# Altium schematic sheet RT1064_Interaction.SchDoc
size A4; SheetNumber: 3; SheetTotal: 4
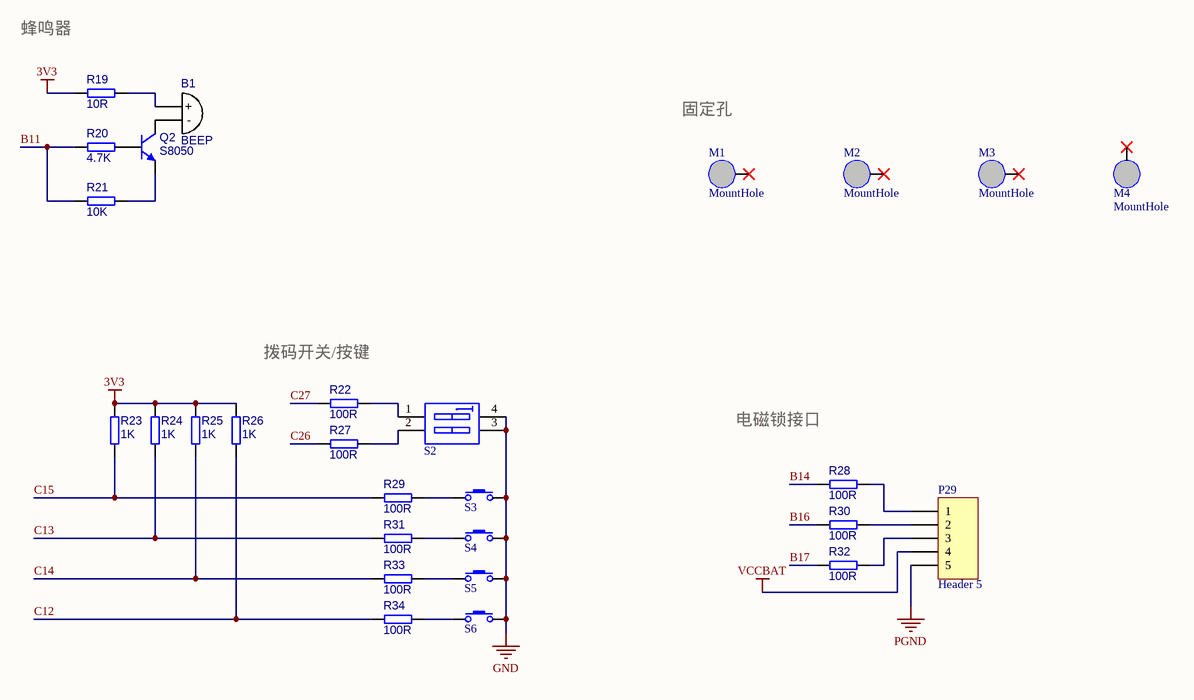
[diagram p0: RT1064_Interaction.SchDoc]

## Parts
B1  BEEP  [BEEP 9x5.5mm]
M1  MountHole  [M3-MountHole]  (no BOM)
M2  MountHole  [M3-MountHole]  (no BOM)
M3  MountHole  [M3-MountHole]  (no BOM)
M4  MountHole  [M3-MountHole]  (no BOM)
P29  Header 5  [HDR1X5]
Q2  S8050  [SOT-23]
R19  value 10R  [RESC1608[0603]S-L]  (hidden comment: 10R ±1%)
R20  value 4.7K  [RESC1608[0603]S-L]  (hidden comment: 4.7K ±1%)
R21  value 10K  [RESC1608[0603]S-L]  (hidden comment: 10K ±1%)
R22  value 100R  [RESC1608[0603]S-L]  (hidden comment: 100R ±1%)
R23  value 1K  [RESC1608[0603]S-L]  (hidden comment: 1K ±1%)
R24  value 1K  [RESC1608[0603]S-L]  (hidden comment: 1K ±1%)
R25  value 1K  [RESC1608[0603]S-L]  (hidden comment: 1K ±1%)
R26  value 1K  [RESC1608[0603]S-L]  (hidden comment: 1K ±1%)
R27  value 100R  [RESC1608[0603]S-L]  (hidden comment: 100R ±1%)
R28  value 100R  [RESC1608[0603]S-L]  (hidden comment: 100R ±1%)
R29  value 100R  [RESC1608[0603]S-L]  (hidden comment: 100R ±1%)
R30  value 100R  [RESC1608[0603]S-L]  (hidden comment: 100R ±1%)
R31  value 100R  [RESC1608[0603]S-L]  (hidden comment: 100R ±1%)
R32  value 100R  [RESC1608[0603]S-L]  (hidden comment: 100R ±1%)
R33  value 100R  [RESC1608[0603]S-L]  (hidden comment: 100R ±1%)
R34  value 100R  [RESC1608[0603]S-L]  (hidden comment: 100R ±1%)
S2  SW DIP-2  [Code SW-2-DIP-2.54]  (value not drawn)
S3  Button  [PTS810-3*4-CurvePin]  (value not drawn)
S4  Button  [PTS810-3*4-CurvePin]  (value not drawn)
S5  Button  [PTS810-3*4-CurvePin]  (value not drawn)
S6  Button  [PTS810-3*4-CurvePin]  (value not drawn)

## Nets
3V3: R19.2 R23.1 R24.1 R25.1 R26.1
GND: S2.3(B2) S2.4(B1) S3.1 S4.1 S5.1 S6.1
PGND: P29.5
VCCBAT: P29.4
B11: R20.2 R21.2
B14: R28.2
B16: R30.2
B17: R32.2
C12: R26.2 R34.2
C13: R24.2 R31.2
C14: R25.2 R33.2
C15: R23.2 R29.2
C26: R27.2
C27: R22.2
NetB1_1: B1.1(+) R19.1
NetB1_2: B1.2(-) Q2.3(C)
NetP29_1: P29.1 R28.1
NetP29_2: P29.2 R30.1
NetP29_3: P29.3 R32.1
NetQ2_1: Q2.1(B) R20.1
NetQ2_2: Q2.2(E) R21.1
NetR22_1: R22.1 S2.1(A1)
NetR27_1: R27.1 S2.2(A2)
NetR29_1: R29.1 S3.2
NetR31_1: R31.1 S4.2
NetR33_1: R33.1 S5.2
NetR34_1: R34.1 S6.2

Not connected (* = marked no-connect by the designer): M1 1*; M2 1*; M3 1*; M4 1*

## Notes on the sheet
- 蜂鸣器
- 固定孔
- 拨码开关/按键
- 电磁锁接口

## Library data of the parts
B1 = BEEP: 蜂鸣器
M1-M4 = MountHole: 固定孔
P29 = Header 5: Header, 5-Pin; LatestRevisionDate: 17-Jul-2002; LatestRevisionNote: Re-released for DXP Platform.; Publisher: Altium Limited
Q2 = NPN S8050: Discrete NPN Bipolar Transistor; Published: 8-Jun-2000; Revision: July-2002: Re-released for DXP Platform.; Publisher: Altium Limited; Price(RMB): 0.000; PartNumber: S8050
R19-R34 = Res-Chip: 贴片电阻; Power: 1/8W; Revision: V1.0; Tolerance: ±1%
S2 = Code SW-2: 2位拨码开关; Published: 24-Mar-1999; Revision: July-2002: Re-released for DXP Platform.; Publisher: Altium Limited; Price(RMB): 0.000
S3-S6 = KEY: 按键; Published: 24-Mar-1999; Publisher: Altium Limited; Price(RMB): 0.000